# Altium schematic sheet BSPD_Retencion_SCH.SchDoc: BPSD - Retencion estado
size A4; Author: FSAE MotorSport UTN; Organization: UTN; Revision: 1.0; SheetNumber: 3; SheetTotal: 3
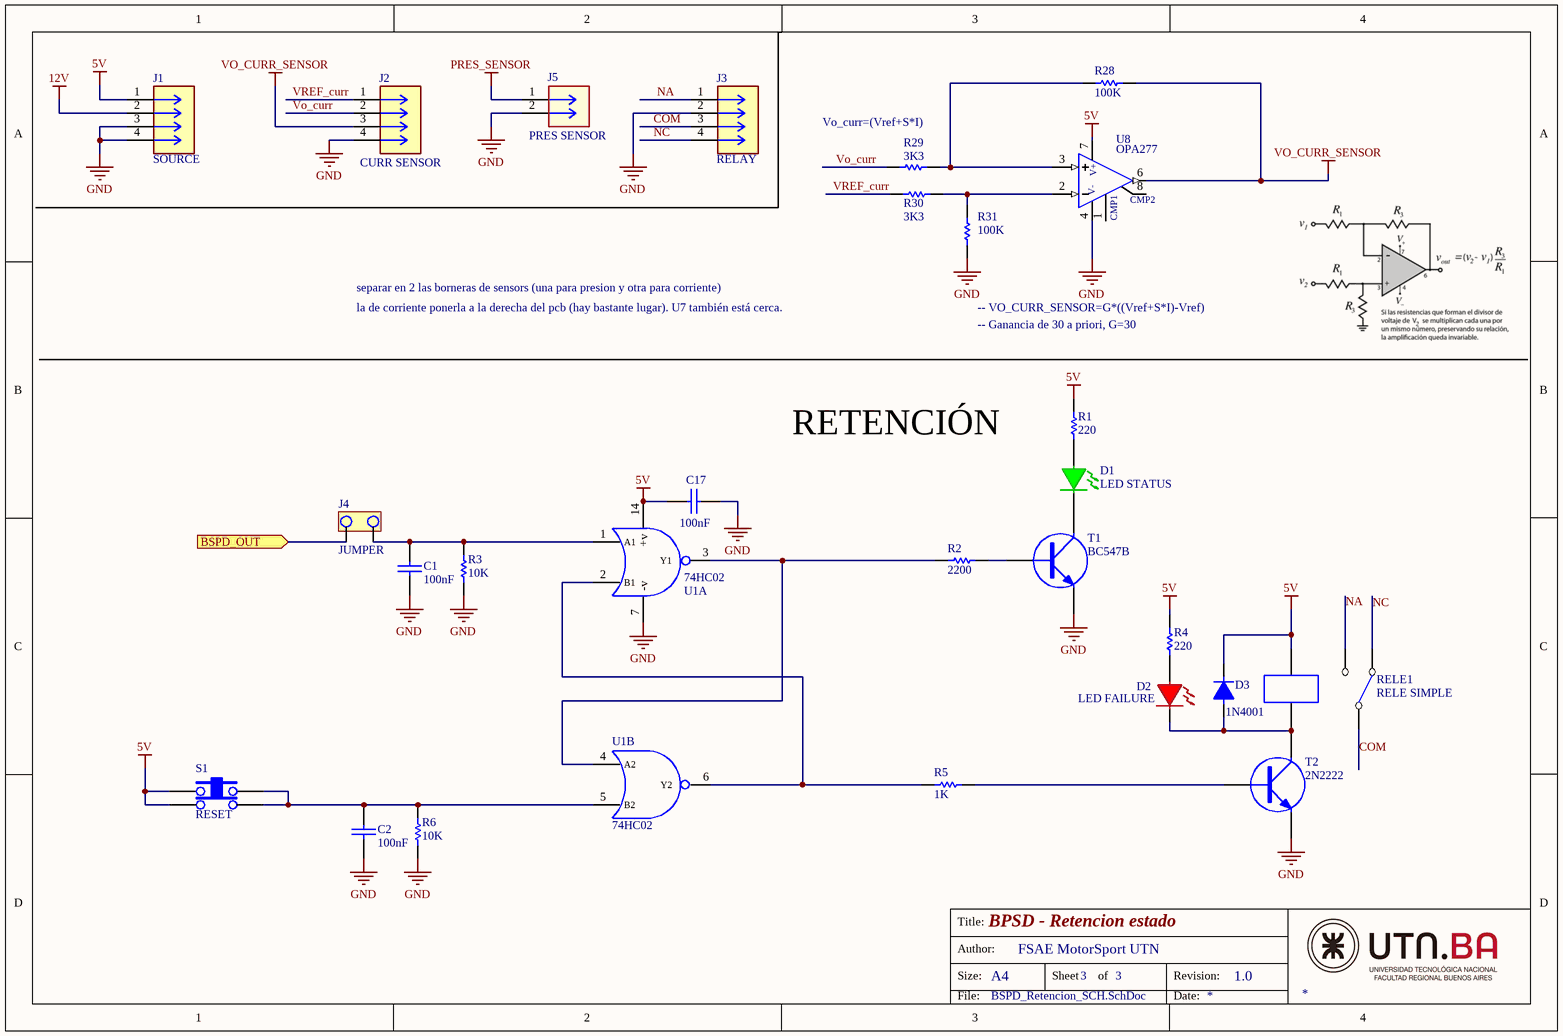
[diagram p0: BSPD_Retencion_SCH.SchDoc]

## Parts
C1  100nF  [CAP200]
C2  100nF  [CAP200]
C17  100nF  [CAP200]
D1  LED STATUS  [LED 3 - Green]
D2  LED FAILURE  [LED 3 - Red]
D3  1N4001  [DO41]
J1  SOURCE  [CONN_SD-44067-001_04_MOL]
J2  CURR SENSOR  [CONN_SD-44067-001_04_MOL]
J3  RELAY  [CONN_SD-44067-001_04_MOL]
J4  JUMPER  [JUMPER2]
J5  PRES SENSOR  [CONN_SD-44067-001_02_MOL]
R1  220  [RES400]
R2  2200  [RES400]
R3  10K  [RES400]
R4  220  [RES400]
R5  1K  [RES400]
R6  10K  [RES400]
R28  100K  [RES400]
R29  3K3  [RES400]
R30  3K3  [RES400]
R31  100K  [RES400]
RELE1  RELE SIMPLE  [RELE SERIE 943]
S1  RESET  [TACTSWITCH]
T1  BC547B  [TO92]
T2  2N2222  [TO-18]
U1  74HC02  [DIP14]  (parts A,B of 4)
U8  OPA277  [DIP8]

## Ports
BSPD_OUT (in)

## Nets
5V: C17.1 D3.2 J1.1 R1.2 R4.2 RELE1.B1 S1.1 S1.2 U1.14(+v) U8.7(V+)
12V: J1.2
GND: C1.2 C2.2 C17.2 J1.3 J1.4 J2.4 J3.2 J5.2 R3.1 R6.1 R31.2 T1.3(E) T2.3(E) U1.7(-v) U8.4(V-)
PRES_SENSOR: J5.1
VO_CURR_SENSOR: J2.3 R28.1 U8.6(OUT)
BSPD_OUT: J4.2 ; port BSPD_OUT
COM: J3.3 RELE1.C1
NA: J3.1 RELE1.NA1
NC: J3.4 RELE1.NC1
Vo_curr: J2.2 R29.2
VREF_curr: J2.1 R30.2
NetC1_1: C1.1 J4.1 R3.2 U1.1(A1)
NetC2_1: C2.1 R6.2 S1.3 S1.4 U1.5(B2)
NetD1_1: D1.1 R1.1
NetD1_2: D1.2 T1.2(C)
NetD2_1: D2.1 R4.1
NetD2_2: D2.2 D3.1 RELE1.B2 T2.2(C)
NetR2_1: R2.1 U1.3(Y1) U1.4(A2)
NetR2_2: R2.2 T1.1(B)
NetR5_1: R5.1 U1.2(B1) U1.6(Y2)
NetR5_2: R5.2 T2.1(B)
NetR28_2: R28.2 R29.1 U8.3(+IN)
NetR30_1: R30.1 R31.1 U8.2(-IN)

Not connected (* = marked no-connect by the designer): U8 1(CMP1) 8(CMP2)

## Notes on the sheet
- (near R29) Vo_curr=(Vref+S*I)
- separar en 2 las borneras de sensors (una para presion y otra para corriente)
- la de corriente ponerla a la derecha del pcb (hay bastante lugar). U7 también está cerca.
- -- VO_CURR_SENSOR=G*((Vref+S*I)-Vref)
- -- Ganancia de 30 a priori, G=30
- RETENCIÓN
- Title:
- Size:
- Author:
- A4
- Sheet
- of
- Revision:
- File:
- Date:

## Library data of the parts
C1 C2 C17 = CAP
D1 = LED VERDE
D2 = LED ROJO
D3 = 1N4001: Diodo
J1-J3 = MolexMini 4: Molex mini 50 de 4 pines (440670401); MP: 347920040; Package: None; Price: None; Value: *; Availability: Unavailable
J5 = MolexMini 2: Micro-Fit 3.0 Wire-to-Board Header, Dual Row, Vertical for up to 3.56mm Thick PCB, 2 Circuits, Tin (Sn) Plating; Manufacturer_Name: Molex Connector Corporation; Manufacturer_Part_Number: 440670201; Copyright: Copyright (C) 2025 Ultra Librarian. All rights reserved.; RefDes: RefDes; Type: Type
R1-R6 R28-R31 = RES
S1 = TACT SWITCH
T1 T2 = TRANSISTOR NPN
U1 = 74HC02: Compuerta NOR; Autor: SALERNO, Santiago; fecha: 10/05/2019; datasheet: https://cdn.datasheetspdf.com/pdf-down/7/4/H/74HC14-ONSemiconductor.pdf
U8 = OPA277: / Op Amp Single Low Offset Voltage Amplifier Â±18V 8-Pin PDIP Tube /; MF: Texas Instruments; SnapEDA_Link: https://www.snapeda.com/parts/OPA277/Texas+Instruments/view-part/?ref=snap; Package: None; MP: OPA277; Check_prices: https://www.snapeda.com/parts/OPA277/Texas+Instruments/view-part/?ref=eda; Value: *